# Altium schematic sheet DPPXHK_FMUPOWER.SCHDOC
size A4
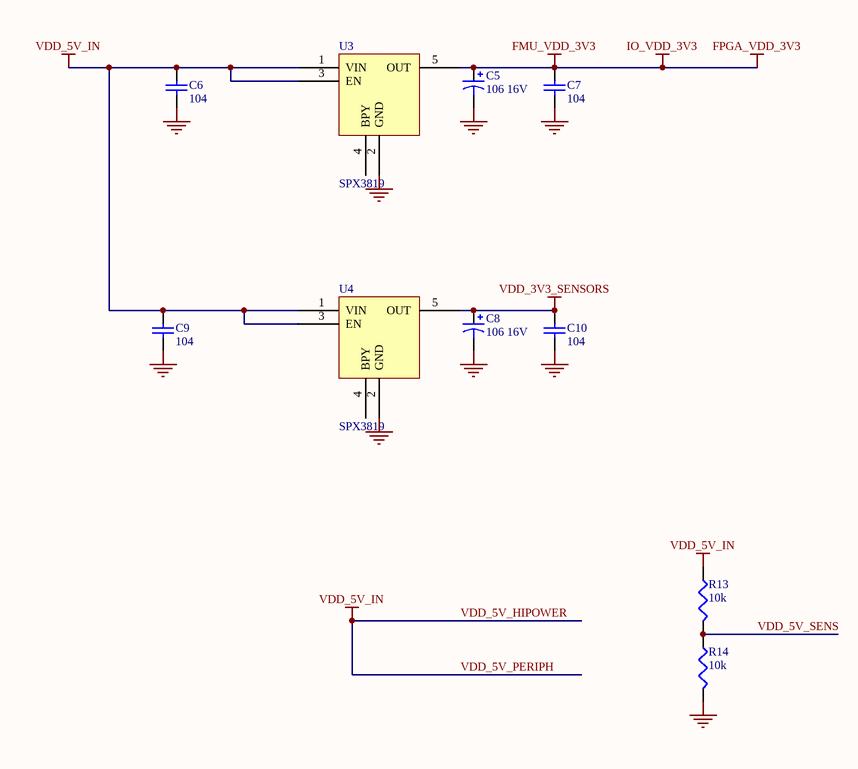
[diagram p0: DPPXHK_FMUPOWER.SCHDOC]

## Parts
C5  106 16V  [LC0402]
C6  104  [LC0402]
C7  104  [LC0402]
C8  106 16V  [LC0402]
C9  104  [LC0402]
C10  104  [LC0402]
R13  10k  [0402R]
R14  10k  [0402R]
U3  SPX3819  [SOT-23-5]
U4  SPX3819  [SOT-23-5]

## Nets
FMU_VDD_3V3: C5.1 C7.2 U3.5(OUT)  [also labelled FPGA_VDD_3V3, IO_VDD_3V3]
GND: C5.2 C6.1 C7.1 C8.2 C9.1 C10.1 R14.2 U3.2(GND) U4.2(GND)
VDD_3V3_SENSORS: C8.1 C10.2 U4.5(OUT)
VDD_5V_HIPOWER: C6.2 C9.2 R13.1 U3.1(VIN) U3.3(EN) U4.1(VIN) U4.3(EN)  [also labelled VDD_5V_IN, VDD_5V_PERIPH]
VDD_5V_SENS: R13.2 R14.1

Not connected (* = marked no-connect by the designer): U3 4(BPY); U4 4(BPY)

## Library data of the parts
C5 C8 = Cap Pol3: Polarized Capacitor (Surface Mount); Published: 8-Jun-2000; LatestRevisionDate: 17-Jul-2002; LatestRevisionNote: Re-released for DXP Platform.; PackageReference: C0805; Publisher: Altium Limited
C6 C7 C9 C10 = Cap Semi: Capacitor (Semiconductor SIM Model); Published: 8-Jun-2000; LatestRevisionDate: 17-Jul-2002; LatestRevisionNote: Re-released for DXP Platform.; PackageReference: C1206; Publisher: Altium Limited
R13 R14 = Res3: Resistor; Published: 8-Jun-2000; LatestRevisionDate: 4-Mar-2005; LatestRevisionNote: PCB Footprint replaced.; Publisher: Altium Limited